# EAGLE design 2-Lead ECG (EAGLE 9.6.1)

## Sheet 1 of 2
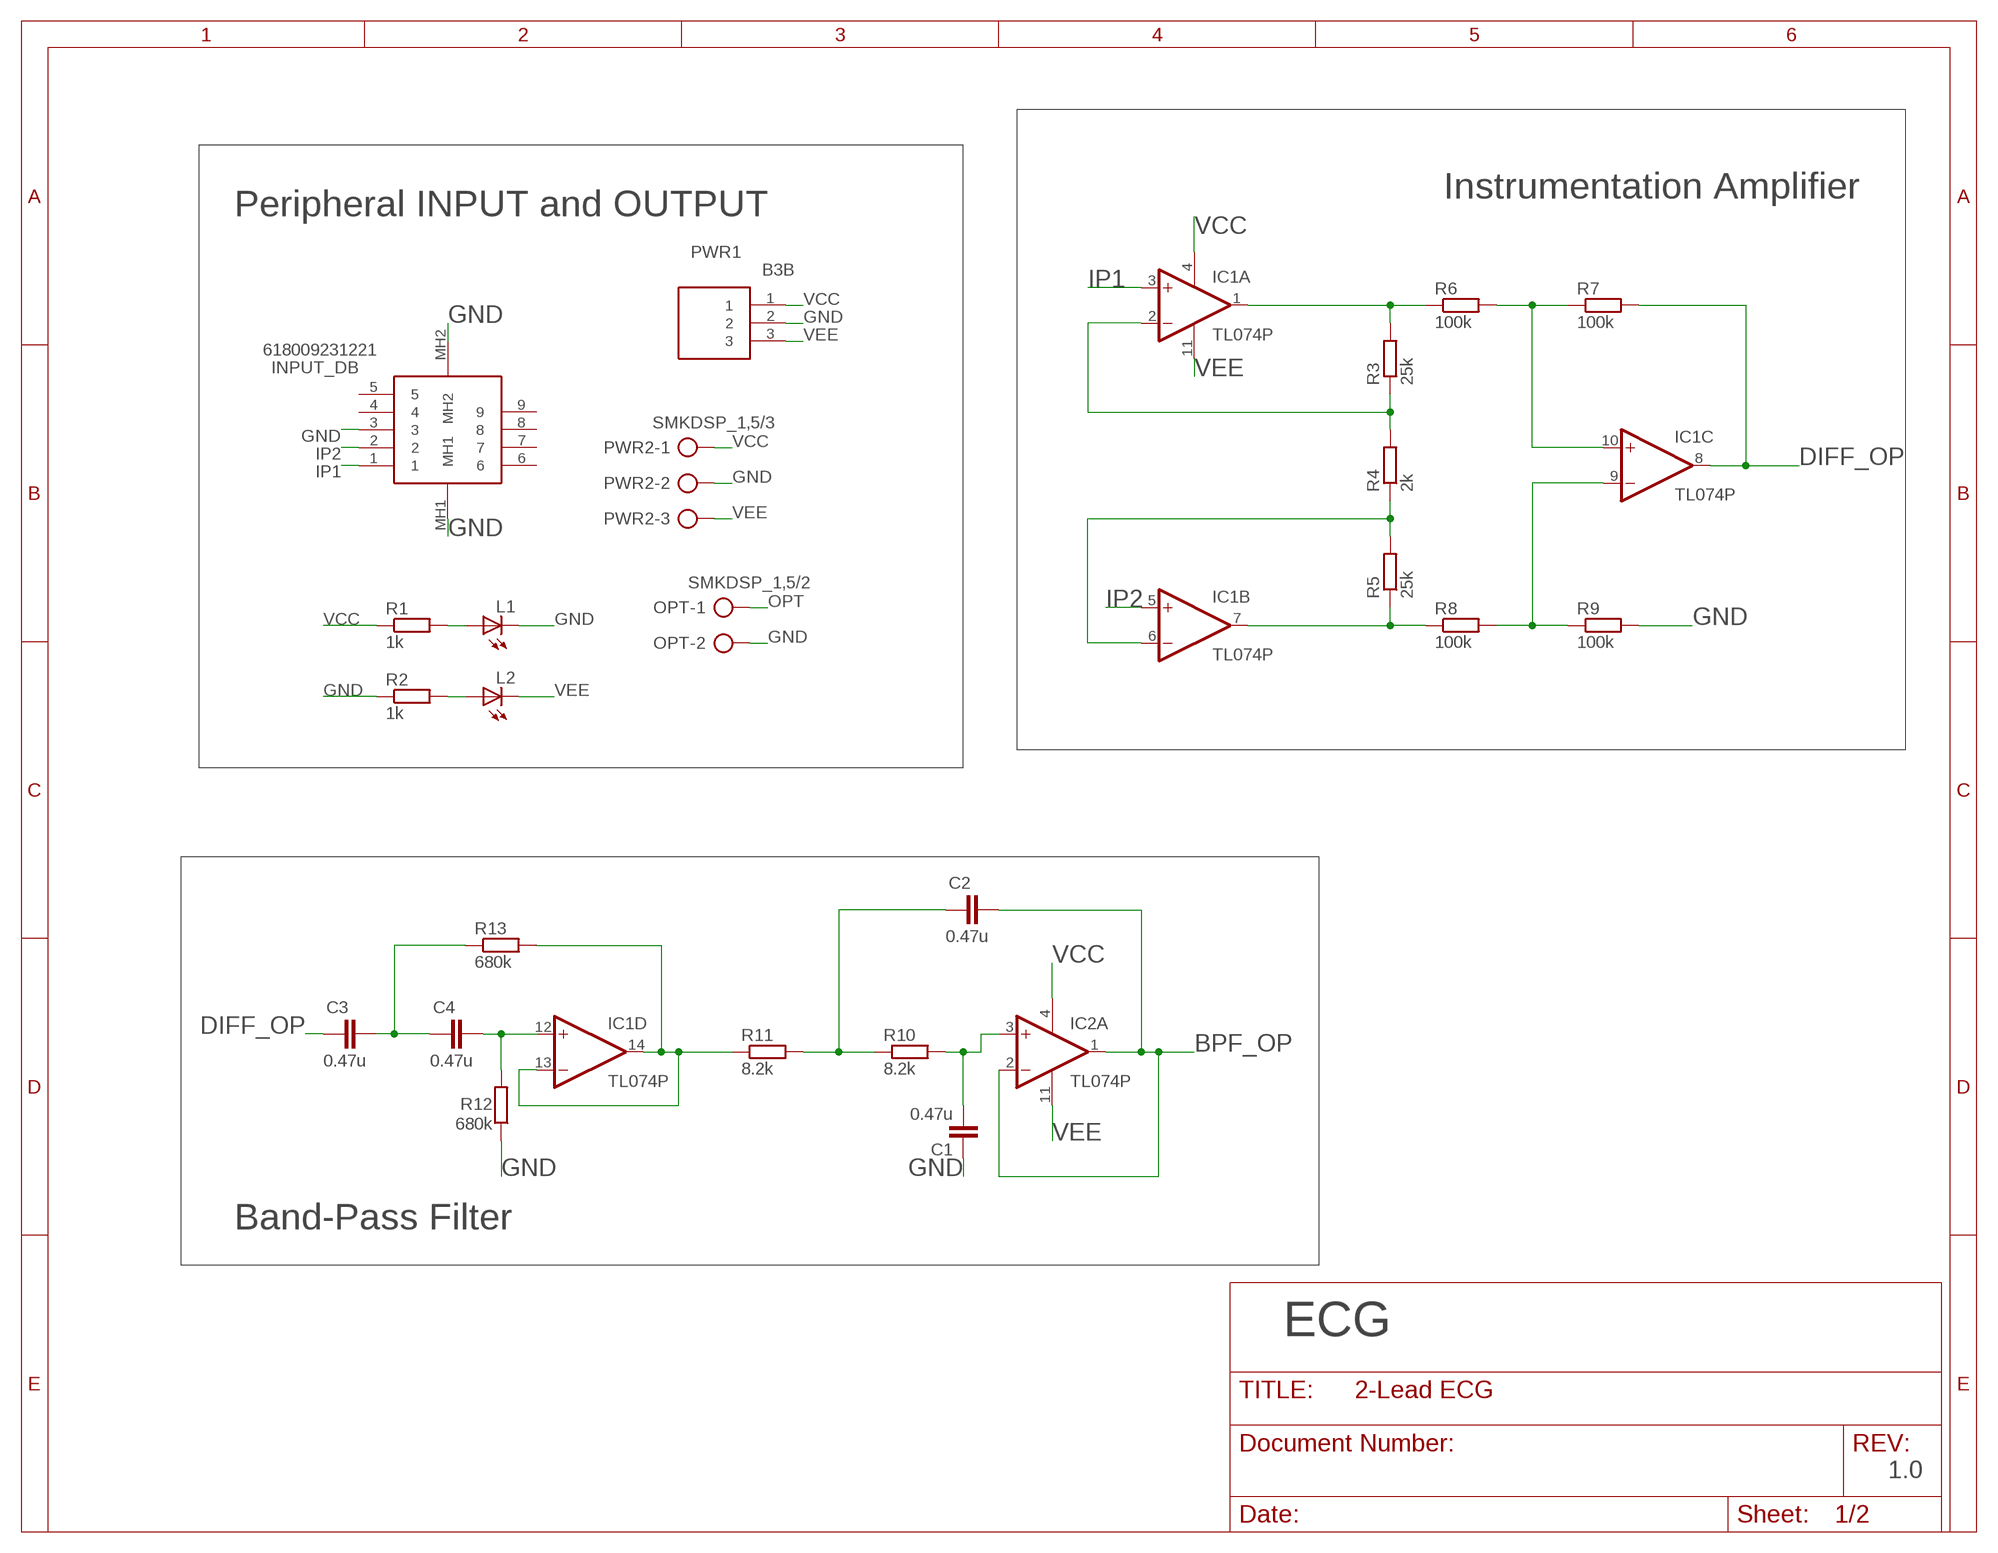
[diagram p0: schematic, sheet 1]

### Parts
C1  0.47u  C-EU050-025X075  [C050-025X075]
C2  0.47u  C-EU050-025X075  [C050-025X075]
C3  0.47u  C-EU050-025X075  [C050-025X075]
C4  0.47u  C-EU050-025X075  [C050-025X075]
IC1  TL074P  [DIL14]
IC2  TL074P  [DIL14]
INPUT_DB  618009231221  [618009231221]
L1  LED3MM  [LED3MM]
L2  LED3MM  [LED3MM]
OPT  SMKDSP_1,5/2  [SMKDSP_1,5/2]
PWR1  B3B  B3B-EH-A__LF___SN_  [SHDR3W64P0X250_1X3_1000X380X60]
PWR2  SMKDSP_1,5/3  [SMKDSP_1,5/3]
R1  1k  R-EU_0207/10  [0207/10]
R2  1k  R-EU_0207/10  [0207/10]
R3  25k  R-EU_0204/2V  [0204V]
R4  2k  R-EU_0207/10  [0207/10]
R5  25k  R-EU_0204/2V  [0204V]
R6  100k  R-EU_0207/10  [0207/10]
R7  100k  R-EU_0207/10  [0207/10]
R8  100k  R-EU_0207/10  [0207/10]
R9  100k  R-EU_0207/10  [0207/10]
R10  8.2k  R-EU_0207/10  [0207/10]
R11  8.2k  R-EU_0207/10  [0207/10]
R12  680k  R-EU_0207/10  [0207/10]
R13  680k  R-EU_0207/10  [0207/10]

### Nets
BPF_OP: C2.2 IC2.1(A:OUT) IC2.2(A:-IN) ; also sheet 2
DIFF_OP: C3.1 IC1.8(C:OUT) R7.2
GND: C1.1 INPUT_DB.3 INPUT_DB.MH1 INPUT_DB.MH2 L1.K(C) OPT.2 PWR1.2 PWR2.2 R2.1 R9.2 R12.1 ; also sheet 2
IP1: IC1.3(A:+IN) INPUT_DB.1
IP2: IC1.5(B:+IN) INPUT_DB.2
N$1: L1.A R1.2
N$2: L2.A R2.2
N$3: IC1.1(A:OUT) R3.2 R6.1
N$4: IC1.2(A:-IN) R3.1 R4.2
N$5: IC1.6(B:-IN) R4.1 R5.2
N$6: IC1.7(B:OUT) R5.1 R8.1
N$7: IC1.10(C:+IN) R6.2 R7.1
N$8: IC1.9(C:-IN) R8.2 R9.1
N$9: C3.2 C4.1 R13.1
N$10: IC1.13(D:-IN) IC1.14(D:OUT) R11.1 R13.2
N$11: C4.2 IC1.12(D:+IN) R12.2
N$12: C2.1 R10.1 R11.2
N$13: C1.2 IC2.3(A:+IN) R10.2
OPT: OPT.1 ; also sheet 2
VCC: IC1.4(P:V+) IC2.4(P:V+) PWR1.1 PWR2.1 R1.1 ; also sheet 2
VEE: IC1.11(P:V-) IC2.11(P:V-) L2.K(C) PWR1.3 PWR2.3
Unconnected: INPUT_DB.4 INPUT_DB.5 INPUT_DB.6 INPUT_DB.7 INPUT_DB.8 INPUT_DB.9

### Notes on the sheet
- Instrumentation Amplifier
- Peripheral INPUT and OUTPUT
- Band-Pass Filter
- ECG
- 1.0

## Sheet 2 of 2
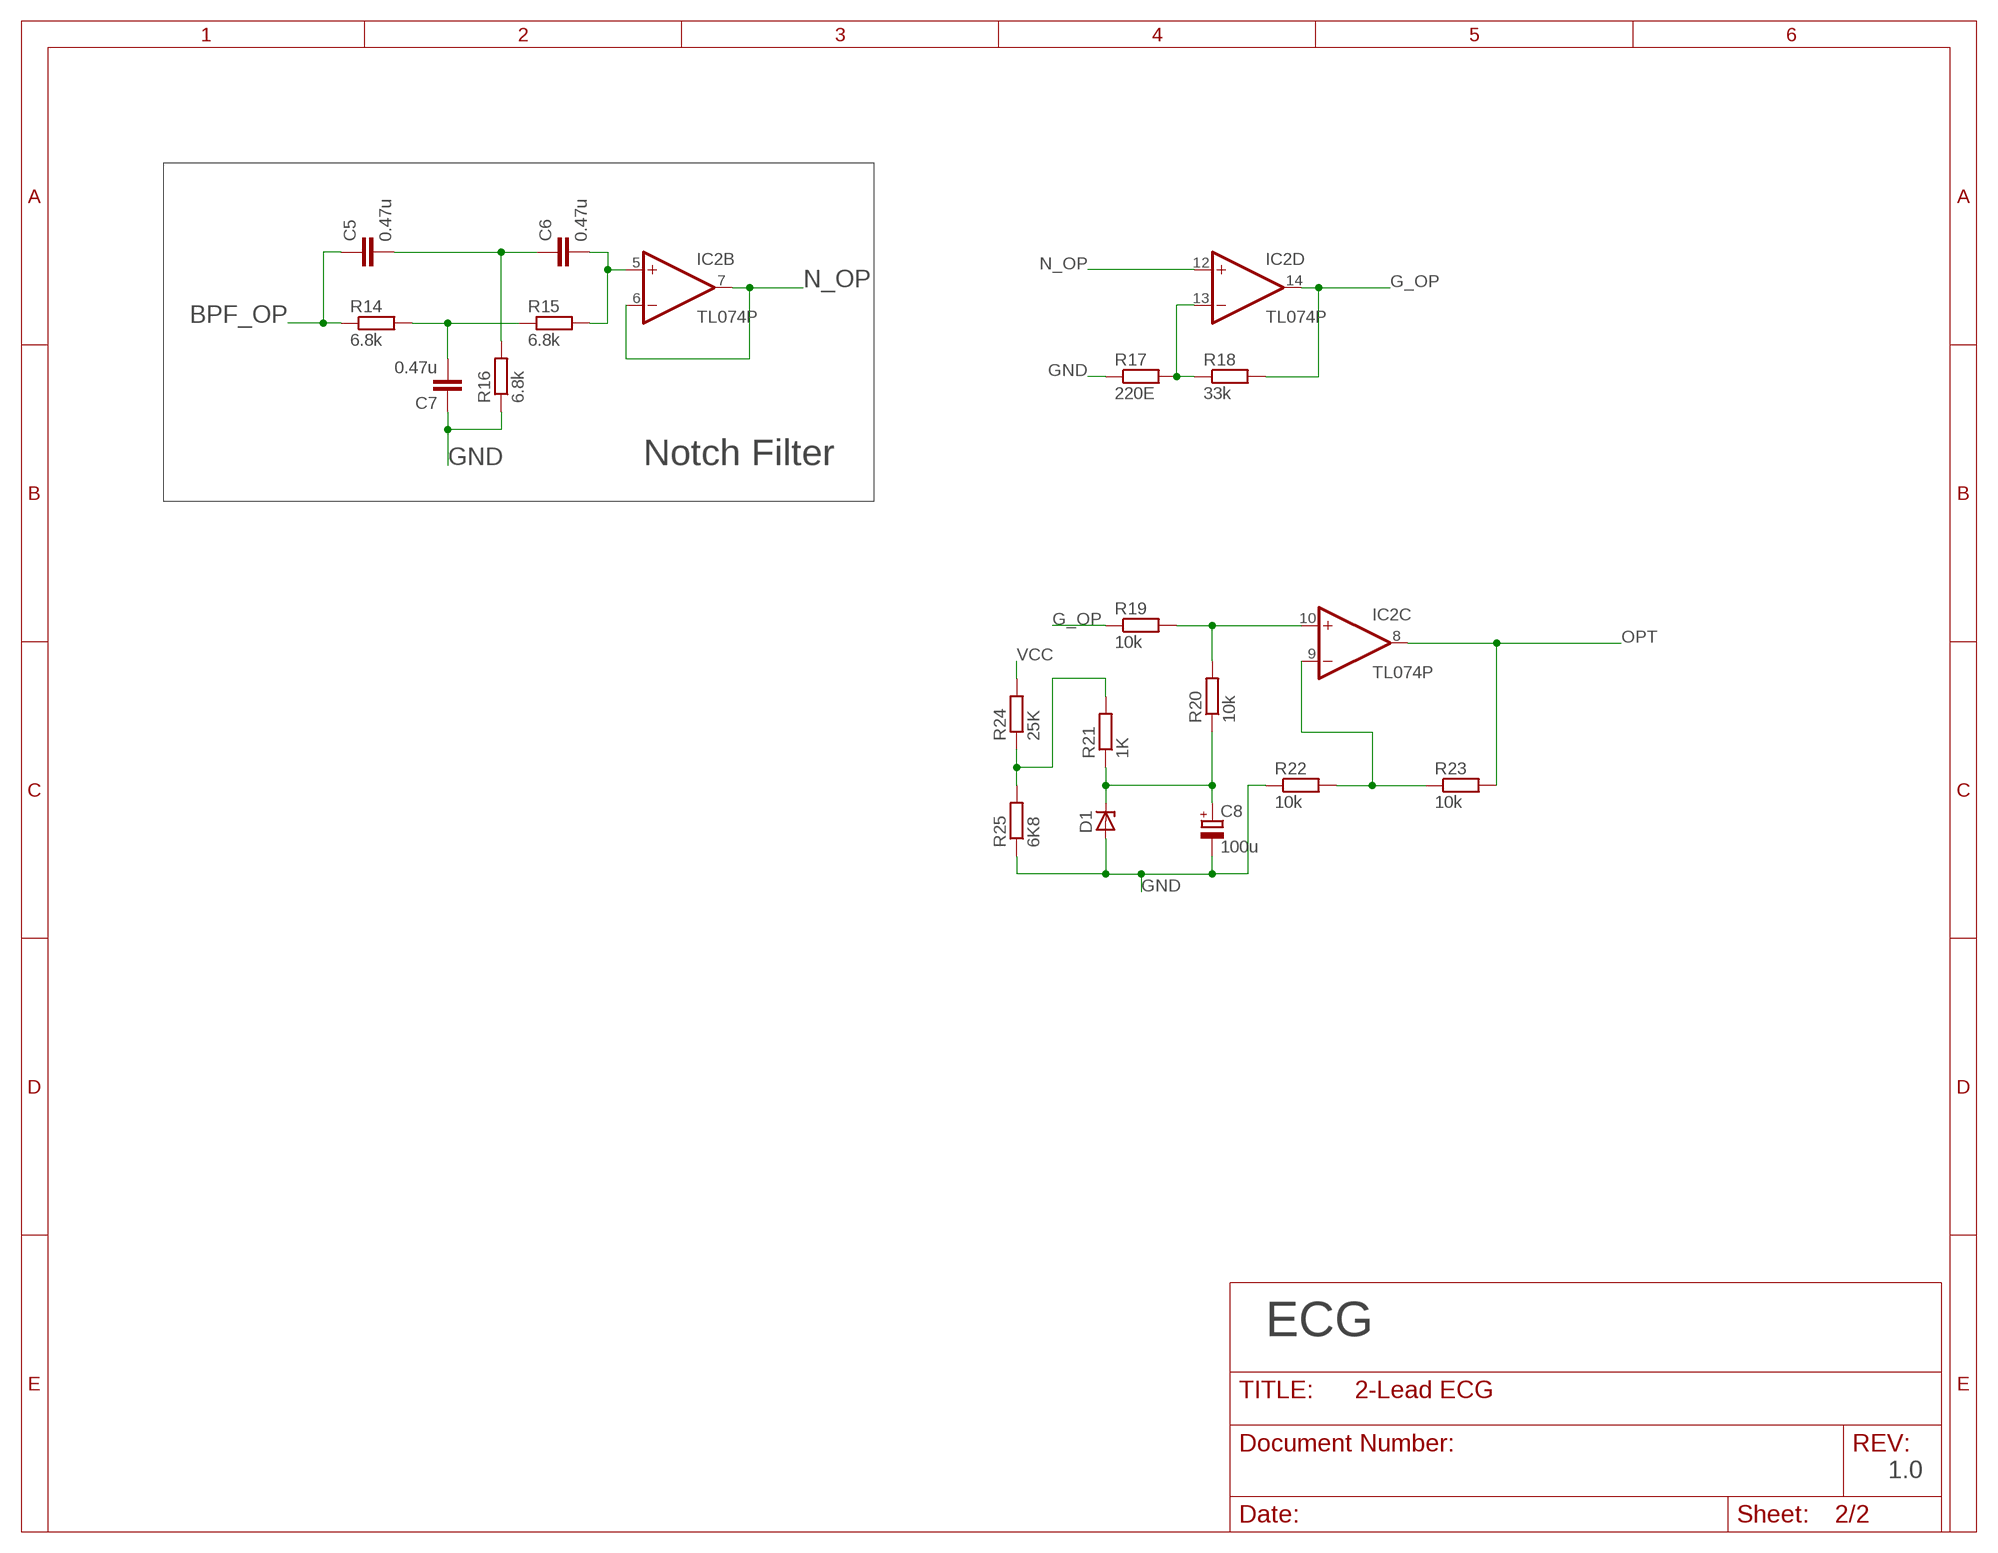
[diagram p1: schematic, sheet 2]

### Parts
C5  0.47u  C-EU050-025X075  [C050-025X075]
C6  0.47u  C-EU050-025X075  [C050-025X075]
C7  0.47u  C-EU050-025X075  [C050-025X075]
C8  100u  CPOL-EUE2.5-5  [E2,5-5]
D1  ZENER-DIODEC1702-15  [C1702-15]
R14  6.8k  R-EU_0207/10  [0207/10]
R15  6.8k  R-EU_0207/10  [0207/10]
R16  6.8k  R-EU_0207/10  [0207/10]
R17  220E  R-EU_0204/2V  [0204V]
R18  33k  R-EU_0204/2V  [0204V]
R19  10k  R-EU_0204/2V  [0204V]
R20  10k  R-EU_0204/2V  [0204V]
R21  1K  R-EU_0207/10  [0207/10]
R22  10k  R-EU_0204/2V  [0204V]
R23  10k  R-EU_0204/2V  [0204V]
R24  25K  R-EU_0207/10  [0207/10]
R25  6K8  R-EU_0207/10  [0207/10]

### Nets
BPF_OP: C5.1 R14.1 ; also sheet 1
G_OP: IC2.14(D:OUT) R18.2 R19.1
GND: C7.1 C8.- D1.A R16.1 R17.1 R22.1 R25.1 ; also sheet 1
N$14: IC2.13(D:-IN) R17.2 R18.1
N$15: C5.2 C6.1 R16.2
N$16: C6.2 IC2.5(B:+IN) R15.2
N$17: C7.2 R14.2 R15.1
N$20: IC2.10(C:+IN) R19.2 R20.2
N$21: IC2.9(C:-IN) R22.2 R23.1
N$22: R21.2 R24.1 R25.2
N$26: C8.+ D1.C R20.1 R21.1
N_OP: IC2.6(B:-IN) IC2.7(B:OUT) IC2.12(D:+IN)
OPT: IC2.8(C:OUT) R23.2 ; also sheet 1
VCC: R24.2 ; also sheet 1

### Notes on the sheet
- Notch Filter
- ECG
- 1.0

## Library data of the parts
C1-C7 = resistor:C-EU: CAPACITOR, European symbol
C8 = resistor:CPOL-EU: POLARIZED CAPACITOR, European symbol
D1 = diode:ZENER-DIODE: Z-Diode
IC1 IC2 = linear:TL074: OP AMP
INPUT_DB = SamacSys_Parts:618009231221: Wurth Elektronik 618 Series 2.77 mm, 2.84 mm Pitch 9 Way Right Angle Through Hole Mount PCB D-sub Connector, Plug Source: Datasheet <http://katalog.we-online.de/em/datasheet/6180xx231221.pdf>; ARROW_PART_NUMBER: 618009231221; DESCRIPTION: Wurth Elektronik 618 Series 2.77 mm, 2.84 mm Pitch 9 Way Right Angle Through Hole Mount PCB D-sub Connector, Plug; HEIGHT: 12mm; MANUFACTURER_NAME: Wurth Elektronik; MANUFACTURER_PART_NUMBER: 618009231221; MOUSER_PART_NUMBER: 710-618009231221; MOUSER_PRICE-STOCK: https://www.mouser.co.uk/ProductDetail/Wurth-Elektronik/618009231221?qs=ZtY9WdtwX55zfDFrGhavmg%3D%3D
L1 L2 = led:LED: LED OSRAM: - CHIPLED LG R971, LG N971, LY N971, LG Q971, LY Q971, LO R971, LY R971 LH N974, LH R974 LS Q976, LO Q976, LY Q976 LO Q996 - Hyper CHIPLED LW Q18S LB Q993, LB Q99A, LB R99A - SideLED LS A670, LO A670, LY A670, LG A670, LP A670 LB A673, LV A673, LT A673, LW A673 LH A674 LY A675 LS A676, LA A676, LO A676, LY A676, LW A676 LS A679, LY A679, LG A679 - Hyper Micro SIDELED® LS Y876, LA Y876, LO Y876, LY Y876 LT Y87S - SmartLED LW L88C, LW L88S LB L89C, LB L89S, LG L890 LS L89K, LO L89K, LY L89K LS L896, LA L896, LO L896, LY L896 - TOPLED LS T670, LO T670, LY T670, LG T670, LP T670 LSG T670, LSP T670, LSY T670, LOP T670, LYG T670 LG T671, LOG T671, LSG T671 LB T673, LV T673, LT T673, LW T673 LH T674 LS T676, LA T676, LO T676, LY T676, LB T676, LH T676, LSB T676, LW T676 LB T67C, LV T67C, LT T67C, LS T67K, LO T67K, LY T67K, LW E67C LS E67B, LA E67B, LO E67B, LY E67B, LB E67C, LV E67C, LT E67C LW T67C LS T679, LY T679, LG T679 LS T770, LO T770, LY T770, LG T770, LP T770 LB T773, LV T773, LT T773, LW T773 LH T774 LS E675, LA E675, LY E675, LS T675 LS T776, LA T776, LO T776, LY T776, LB T776 LHGB T686 LT T68C, LB T68C - Hyper Mini TOPLED® LB M676 - Mini TOPLED Santana® LG M470 LS M47K, LO M47K, LY M47K Source: http://www.osram.convergy.de LUXEON: - LUMILED® LXK2-PW12-R00, LXK2-PW12-S00, LXK2-PW14-U00, LXK2-PW14-V00 LXK2-PM12-R00, LXK2-PM12-S00, LXK2-PM14-U00 LXK2-PE12-Q00, LXK2-PE12-R00, LXK2-PE12-S00, LXK2-PE14-T00, LXK2-PE14-U00 LXK2-PB12-K00, LXK2-PB12-L00, LXK2-PB12-M00, LXK2-PB14-N00, LXK2-PB14-P00, LXK2-PB14-Q00 LXK2-PR12-L00, LXK2-PR12-M00, LXK2-PR14-Q00, LXK2-PR14-R00 LXK2-PD12-Q00, LXK2-PD12-R00, LXK2-PD12-S00 LXK2-PH12-R00, LXK2-PH12-S00 LXK2-PL12-P00, LXK2-PL12-Q00, LXK2-PL12-R00 Source: www.luxeon.com KINGBRIGHT: KA-3528ASYC Source: www.kingbright.com
OPT = con-phoenix-smkdsp:SMKDSP_1,5/2: Printklemme, Nennstrom: 17,5 A, Bemessungsspannung: 250 V, Raster: 5,0 mm Source: http://eshop.phoenixcontact.de .. 1733415.pdf; MF: FARNELL; MPN: 1733570; OC_FARNELL: 3041244; OC_NEWARK: 69C8588
PWR1 = SamacSys_Parts:B3B-EH-A__LF___SN_: 3 way 1 row top entry header,2.5mm pitch JST EH Series, 2.5mm Pitch 3 Way 1 Row Straight PCB Header, Solder Termination, 3A Source: Datasheet <http://www.jst-mfg.com/product/pdf/eng/eEH.pdf>; ARROW_PART_NUMBER: B3B-EH-A (LF) (SN); DESCRIPTION: 3 way 1 row top entry header,2.5mm pitch JST EH Series, 2.5mm Pitch 3 Way 1 Row Straight PCB Header, Solder Termination, 3A; HEIGHT: 6mm; MANUFACTURER_NAME: JST (JAPAN SOLDERLESS TERMINALS); MANUFACTURER_PART_NUMBER: B3B-EH-A (LF) (SN)
PWR2 = con-phoenix-smkdsp:SMKDSP_1,5/3: Printklemme, Nennstrom: 17,5 A, Bemessungsspannung: 250 V, Raster: 5,0 mm Source: http://eshop.phoenixcontact.de .. 1733415.pdf; MF: FARNELL; MPN: 1733583; OC_FARNELL: 3041256; OC_NEWARK: 71C4130
R1-R25 = resistor:R-EU_: RESISTOR, European symbol

## Board
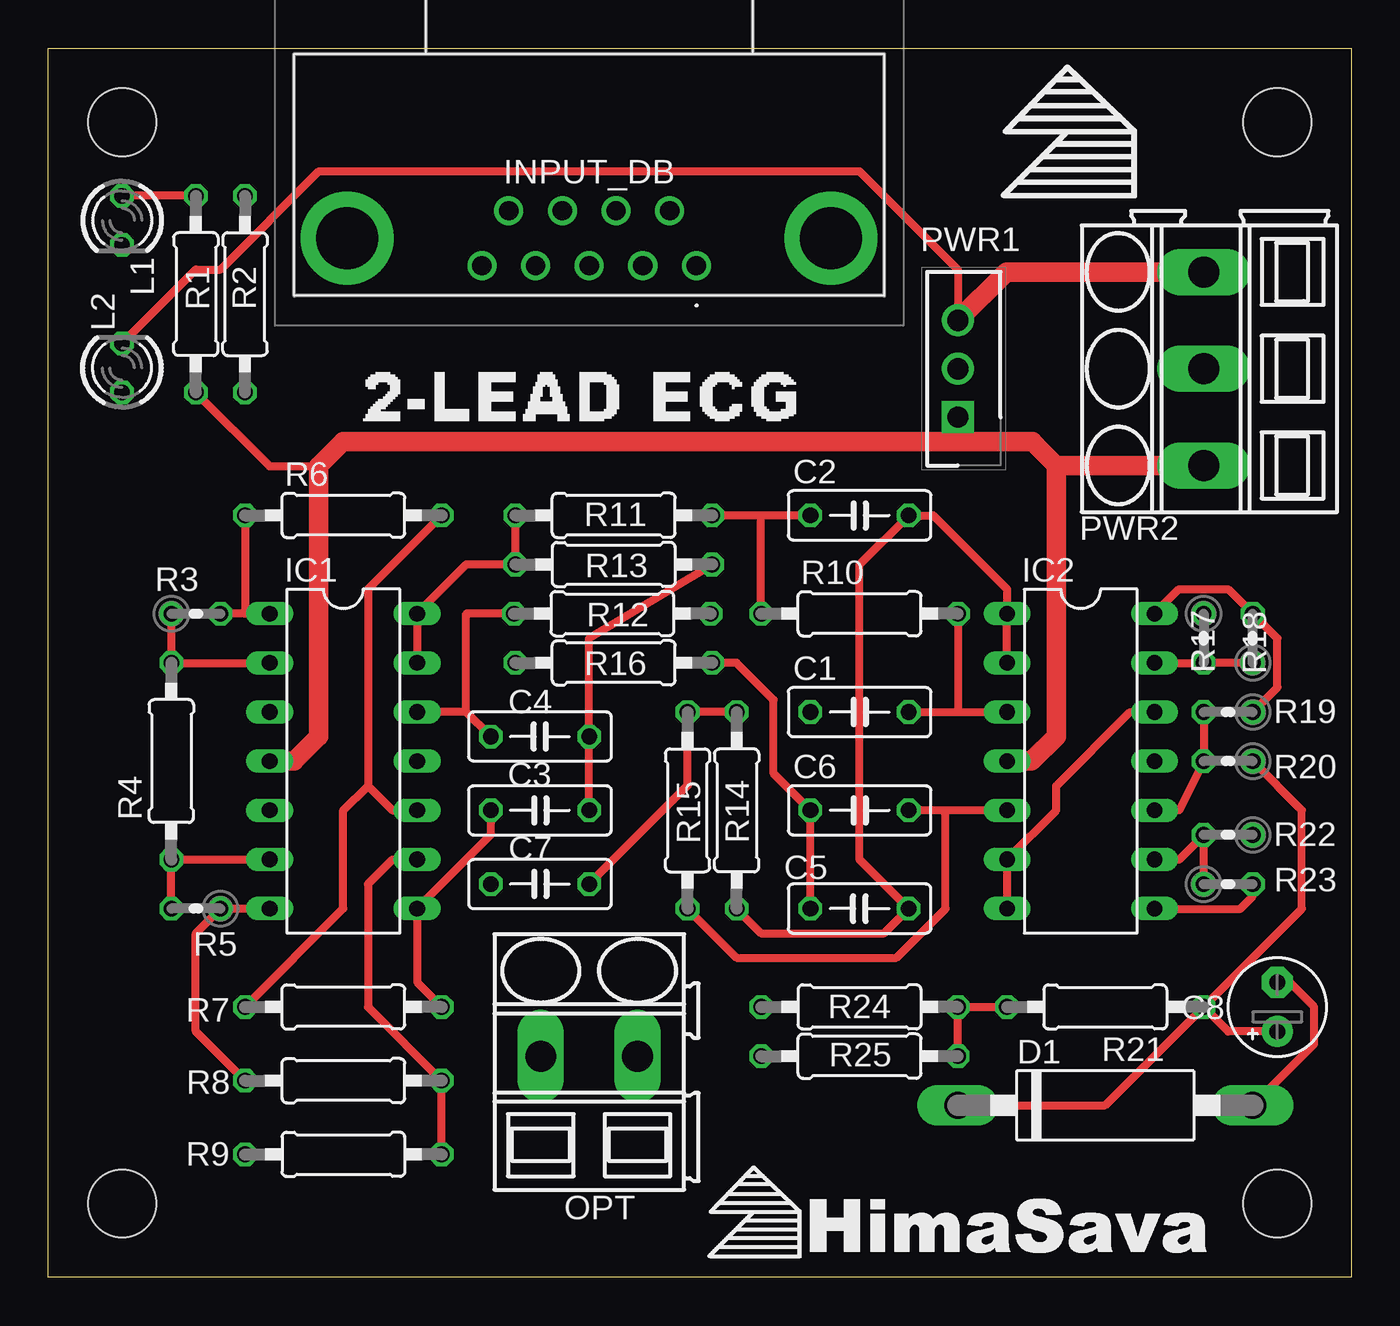
[diagram p2: board, top side]
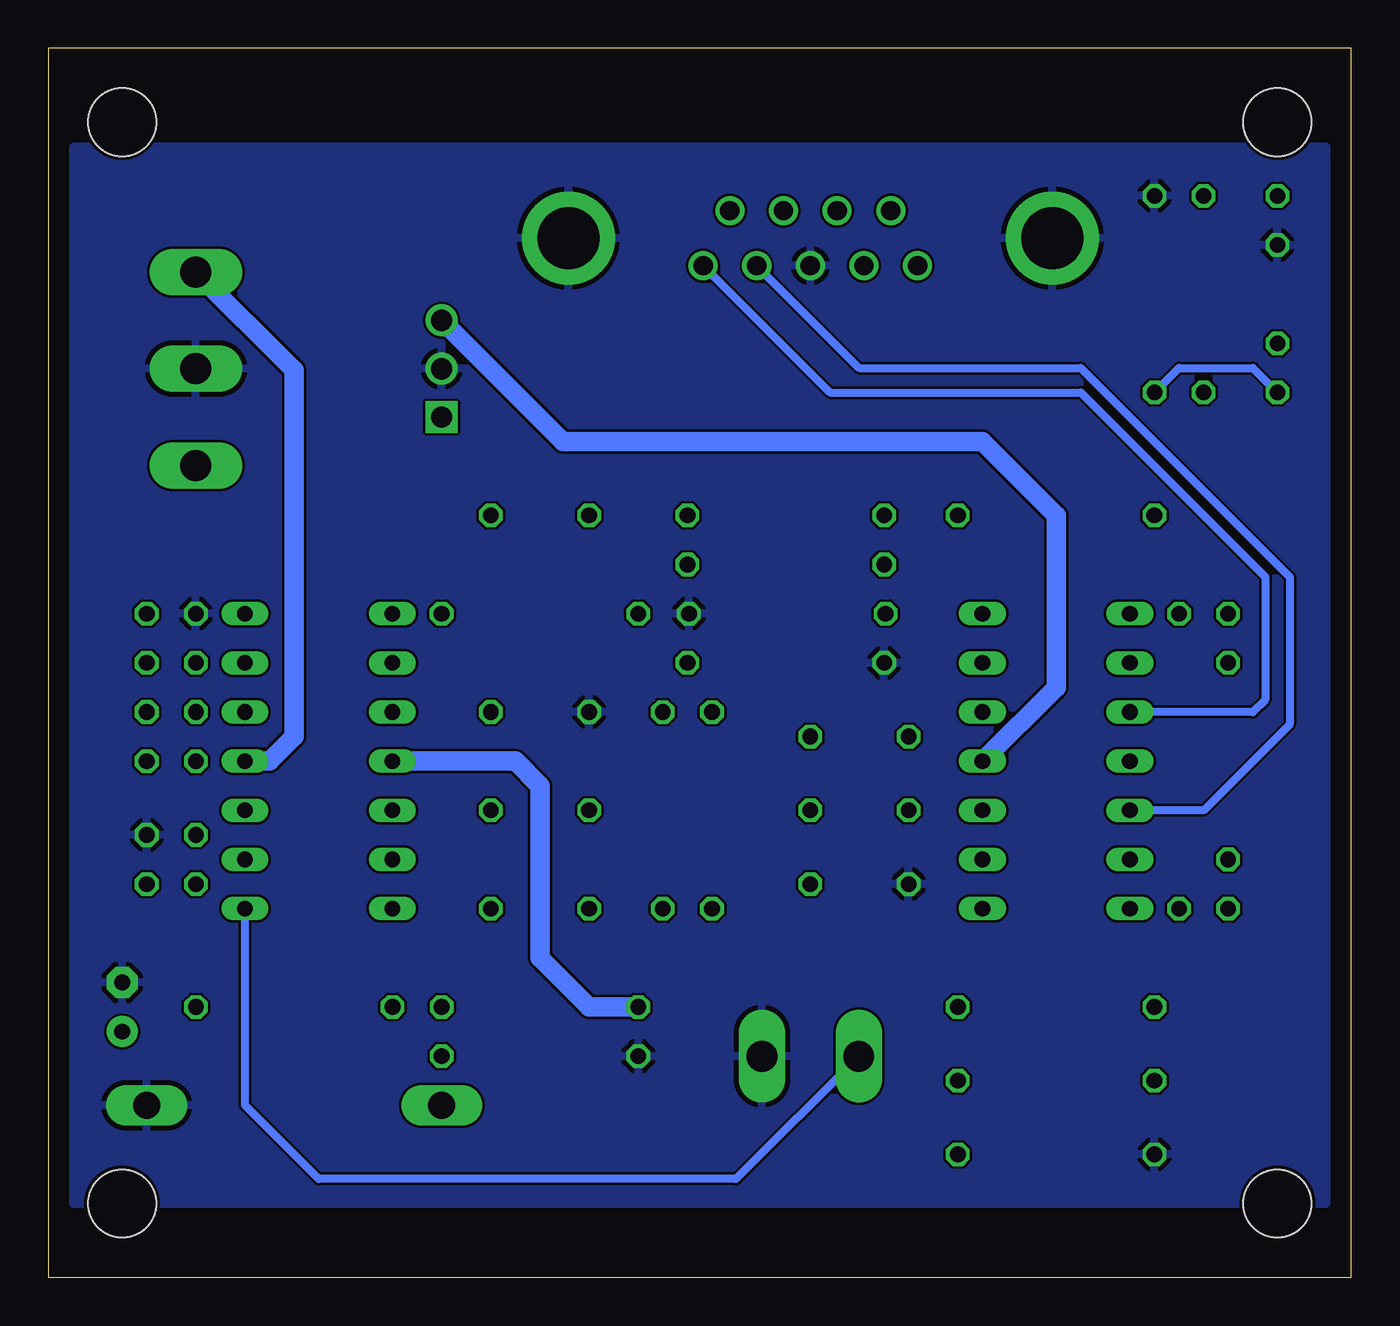
[diagram p3: board, bottom side, seen from below]

Size 67.31 x 63.5 mm. Coordinates in mm from the lower left corner, seen from the top.
Outline: 0,0 0,63.5 67.31,63.5 67.31,0 0,0
Copper layers (1*16): Top 0.035559375mm / dielectric 1.6mm / Bottom 0.035559375mm
Design rules "jlcpcb2layer": minimum track width 5mil, minimum drill 12mil, track to track 5mil, track to pad 5mil, pad to pad 5mil, via to via 5mil, smd to smd 5mil, copper to edge 8mil, drill to drill 6mil, minimum pad ring 5mil, minimum via ring 3mil, stop-mask expansion 2.5mil, vias tented up to drill 0mil, thermal gap 10mil
Holes 3.5 mm at 3.81,3.81 3.81,59.69 63.5,59.69 63.5,3.81

### Footprints (pad centres in the part's own frame; a part is rotated, then mirrored left to right if it is on the bottom)
C050-025X075 = drill 0.813 octagon: 1 -2.54,0; 2 2.54,0
E2,5-5 = drill 0.813 pad 1.6: + -1.27,0 | drill 0.813 pad 1.6 octagon: - 1.27,0
C1702-15 = drill 1.397 long: A 7.62,0; C -7.62,0
DIL14 = drill 0.813 long: 1 -7.62,-3.81; 2 -5.08,-3.81; 3 -2.54,-3.81; 4 0,-3.81; 5 2.54,-3.81; 6 5.08,-3.81; 7 7.62,-3.81; 8 7.62,3.81; 9 5.08,3.81; 10 2.54,3.81; 11 0,3.81; 12 -2.54,3.81; 13 -5.08,3.81; 14 -7.62,3.81
618009231221 = drill 1 pad 1.5: 1 -5.54,7.415; 2 -2.77,7.415; 3 0,7.415; 4 2.77,7.415; 5 5.54,7.415; 6 -4.155,4.575; 7 -1.385,4.575; 8 1.385,4.575; 9 4.155,4.575 | drill 3.2 pad 4.8: MH1 -12.5,5.995; MH2 12.5,5.995
LED3MM = drill 0.813 octagon: A -1.27,0; K 1.27,0
SMKDSP_1,5/2 = drill 1.6 pad 1.8 long: 1 -2.5,0; 2 2.5,0
SHDR3W64P0X250_1X3_1000X380X60 = drill 1.1 pad 1.65 square: 1 0,0 | drill 1.1 pad 1.65: 2 2.5,0; 3 5,0
SMKDSP_1,5/3 = drill 1.6 pad 1.8 long: 1 -2.5,0; 2 2.5,0; 3 7.5,0
0207/10 = drill 0.813 octagon: 1 -5.08,0; 2 5.08,0
0204V = drill 0.813 octagon: 1 -1.27,0; 2 1.27,0

### Placement (x,y rotation side)
C1  41.91,29.21 0 top
C2  41.91,39.37 0 top
C3  25.4,24.13 0 top
C4  25.4,27.94 180 top
C5  41.91,19.05 180 top
C6  41.91,24.13 0 top
C7  25.4,20.32 0 top
C8  63.5,13.97 90 top
D1  54.61,8.89 0 top
IC1  15.24,26.67 270 top
IC2  53.34,26.67 270 top
INPUT_DB  27.94,59.69 180 top
L1  3.81,54.61 270 top
L2  3.81,46.99 90 top
OPT  27.94,11.43 0 top
PWR1  46.99,44.45 90 top
PWR2  59.69,44.45 90 top
R1  7.62,50.8 90 top
R2  10.16,50.8 270 top
R3  7.62,34.29 0 top
R4  6.35,26.67 90 top
R5  7.62,19.05 180 top
R6  15.24,39.37 0 top
R7  15.24,13.97 0 top
R8  15.24,10.16 0 top
R9  15.24,6.35 180 top
R10  41.91,34.29 0 top
R11  29.21,39.37 0 top
R12  29.14,34.29 180 top
R13  29.21,36.83 180 top
R14  35.56,24.13 90 top
R15  33.02,24.13 270 top
R16  29.21,31.75 0 top
R17  59.69,33.02 270 top
R18  62.23,33.02 90 top
R19  60.96,29.21 180 top
R20  60.96,26.67 180 top
R21  54.61,13.97 180 top
R22  60.96,22.86 180 top
R23  60.96,20.32 0 top
R24  41.91,13.97 180 top
R25  41.91,11.43 0 top

### Tracks (layer width: path | path; a pad name or v marks a point on that pad's centre or on a via)
BPF_OP
  Top 0.406: IC2.2 IC2.1 49.53,35.56 45.72,39.37 C2.2 41.91,36.83 41.91,21.59 C5.1 | C5.1 | R14.1 36.83,17.78 43.18,17.78 C5.1
DIFF_OP
  Top 0.406: R7.2 19.05,15.24 IC1.8 22.86,22.86 C3.1
G_OP
  Top 0.406: R19.1 63.5,30.48 63.5,33.02 R18.2 60.96,35.56 58.42,35.56 IC2.14
GND
  Top 0.406: D1.A 65.41,12.06 65.41,13.97 64.14,15.24 C8.-
  pour Bottom: 1.27,3.81 1.27,58.42 66.04,58.42 66.04,3.81
IP1
  Bottom 0.406: INPUT_DB.1 26.92,45.72 13.97,45.72 4.45,36.2 4.45,29.84 5.08,29.21 IC1.3
IP2
  Bottom 0.406: INPUT_DB.2 25.42,46.99 13.97,46.99 3.17,36.2 3.17,28.57 7.62,24.13 IC1.5
N$1
  Top 0.406: R1.2 L1.A
N$2
  Bottom 0.406: R2.2 8.89,46.99 5.08,46.99 L2.A
N$3
  Top 0.406: IC1.1 10.16,34.29 | 10.16,34.29 R3.2 | 10.16,34.29 R6.1
N$4
  Top 0.406: R3.1 R4.2 IC1.2
N$5
  Top 0.406: R5.2 R4.1 IC1.6
N$6
  Top 0.406: R8.1 7.62,12.7 7.62,17.78 R5.1 IC1.7
N$7
  Top 0.406: R6.2 16.51,35.56 16.51,25.4 | 16.51,25.4 17.78,24.13 IC1.10 | R7.1 15.24,19.05 15.24,24.13 16.51,25.4
N$8
  Top 0.406: IC1.9 17.78,21.59 16.51,20.32 16.51,13.97 R8.2 R9.1
N$9
  Top 0.406: C4.1 C3.2 27.94,33.02 R13.1
N$10
  Top 0.406: IC1.13 IC1.14 21.59,36.83 R13.2 R11.1
N$11
  Top 0.406: R12.2 21.59,34.29 21.59,29.21 | 21.59,29.21 IC1.12 | C4.2 21.59,29.21
N$12
  Top 0.406: C2.1 36.83,39.37 | 36.83,39.37 R11.2 | R10.1 36.83,39.37
N$13
  Top 0.406: C1.2 46.99,29.21 | 46.99,29.21 IC2.3 | R10.2 46.99,29.21
N$14
  Top 0.406: R18.1 R17.2 IC2.13
N$15
  Top 0.406: C5.2 C6.1 37.47,26.04 37.47,29.84 35.56,31.75 R16.2
N$16
  Top 0.406: R15.2 35.56,16.51 43.81,16.51 46.35,19.05 46.35,24.13 | IC2.5 46.35,24.13 | 46.35,24.13 C6.2
N$17
  Top 0.406: R14.2 R15.1 33.02,25.4 C7.2
N$20
  Top 0.406: R19.2 R20.2 58.42,24.13 IC2.10
N$21
  Top 0.406: R23.1 R22.2 58.42,21.59 IC2.9
N$22
  Top 0.406: R25.2 R24.1 R21.2 | R21.2
N$26
  Top 0.406: C8.+ 60.96,12.7 R21.1 | R21.1 64.77,19.05 64.77,24.13 R20.1 | D1.C 54.61,8.89 R21.1
N_OP
  Top 0.406: IC2.7 IC2.6 52.07,24.13 52.07,25.4 55.88,29.21 IC2.12
OPT
  Top 0.406: IC2.8 61.59,19.05 62.23,19.68 R23.2
  Bottom 0.406: OPT.1 31.79,5.08 53.34,5.08 57.15,8.89 IC2.8
VCC
  Top 0.406: 13.97,41.91 11.43,41.91 R1.1
  Top 1.016: PWR2.1 52.07,41.95 | IC1.4 12.7,26.67 13.97,27.94 13.97,41.91 15.24,43.18 46.99,43.18 | IC2.4 50.8,26.67 52.07,27.94 52.07,41.95 | 52.07,41.95 50.84,43.18 46.99,43.18 | PWR1.1 46.99,43.19 46.99,43.18
  Bottom 1.016: IC2.4 43.18,26.67 41.91,25.4 41.91,16.51 39.37,13.97 R24.2
VEE
  Top 0.406: L2.K 7.62,52.07 8.89,52.07 13.97,57.15 41.91,57.15 46.99,52.07 PWR1.3
  Top 1.016: PWR1.3 49.49,51.95 PWR2.3
  Bottom 1.016: IC2.11 55.88,26.67 54.61,27.94 54.61,46.87 PWR2.3 | IC1.11 15.24,30.48 15.24,39.37 19.05,43.18 40.72,43.18 PWR1.3

### Text on the board
tPlace: D:/Drive/Logo2.0.bmp | D:/Drive/Logo2.0.bmp